# EasyEDA Pro project Hacker Card PCB.epro

# Board PCB_PCB_Hacker-card_2026-08-12
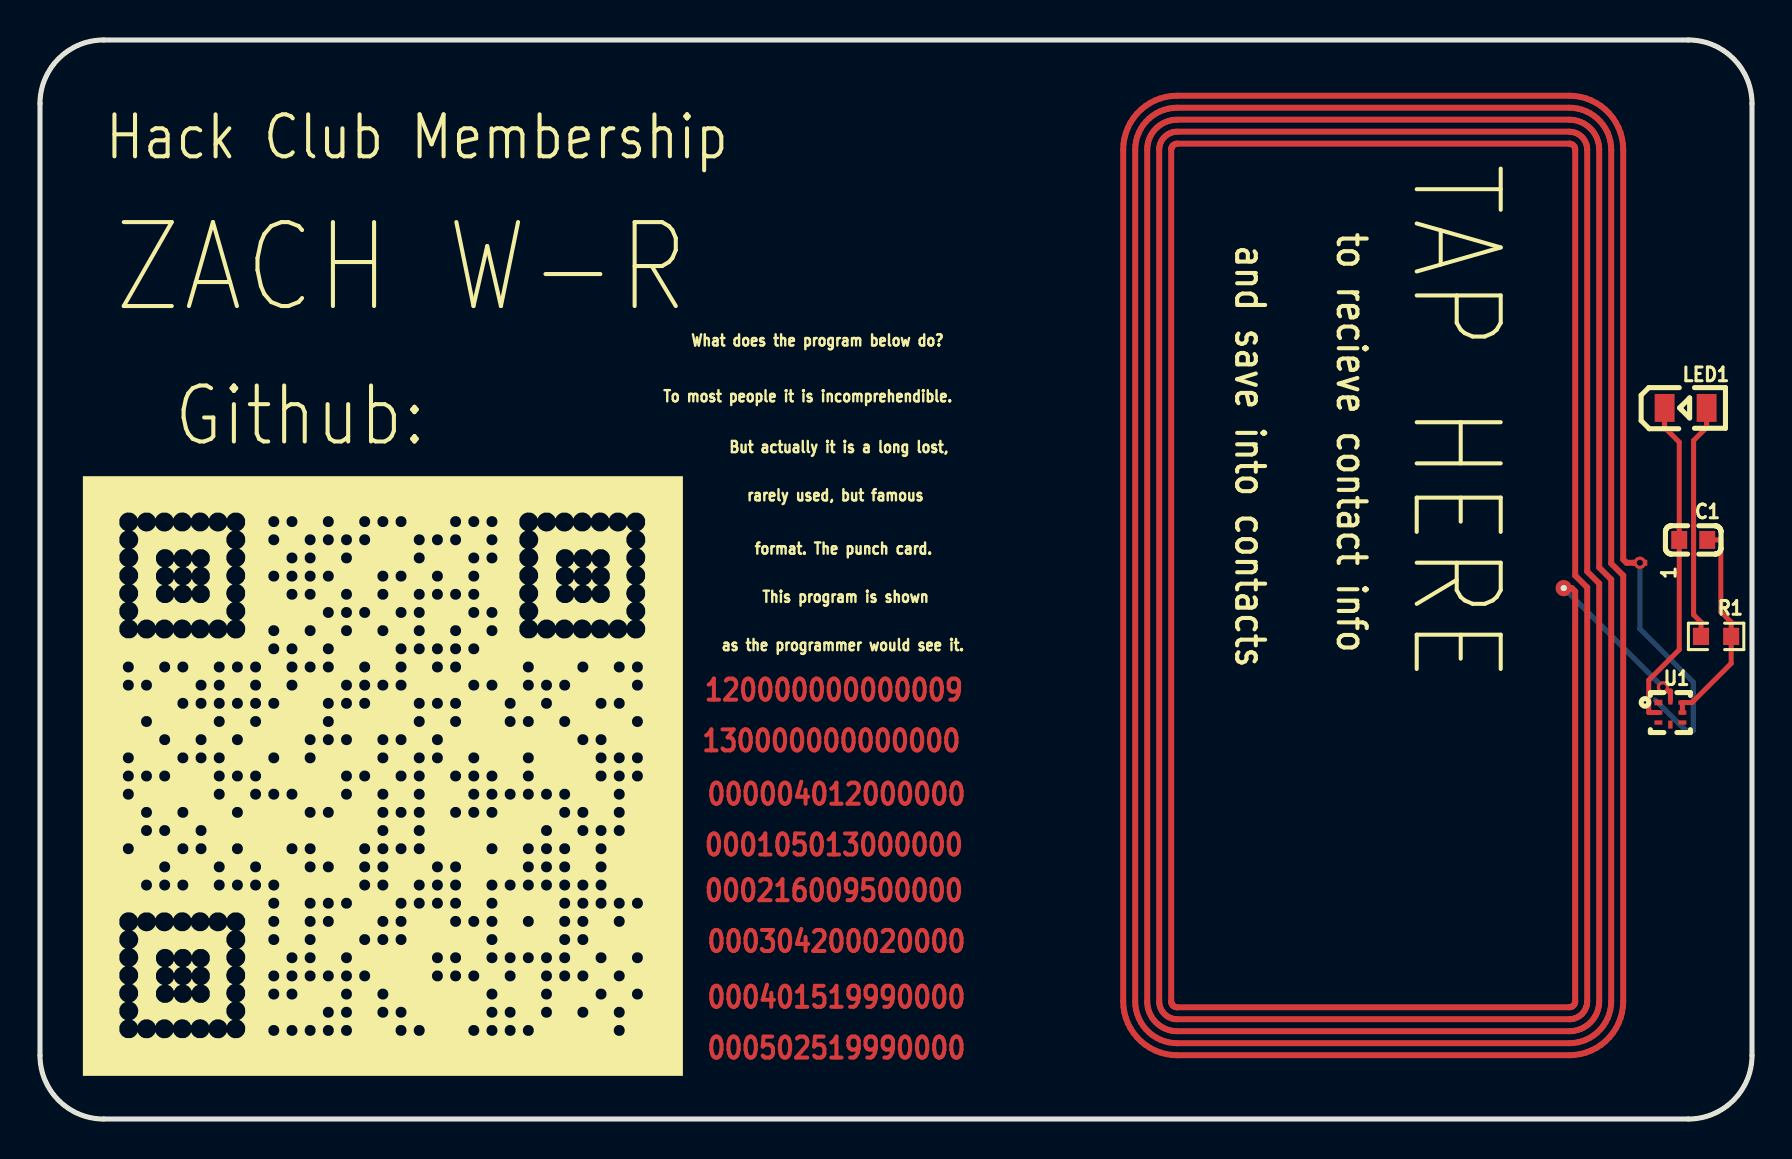
[diagram p0: board, top side]
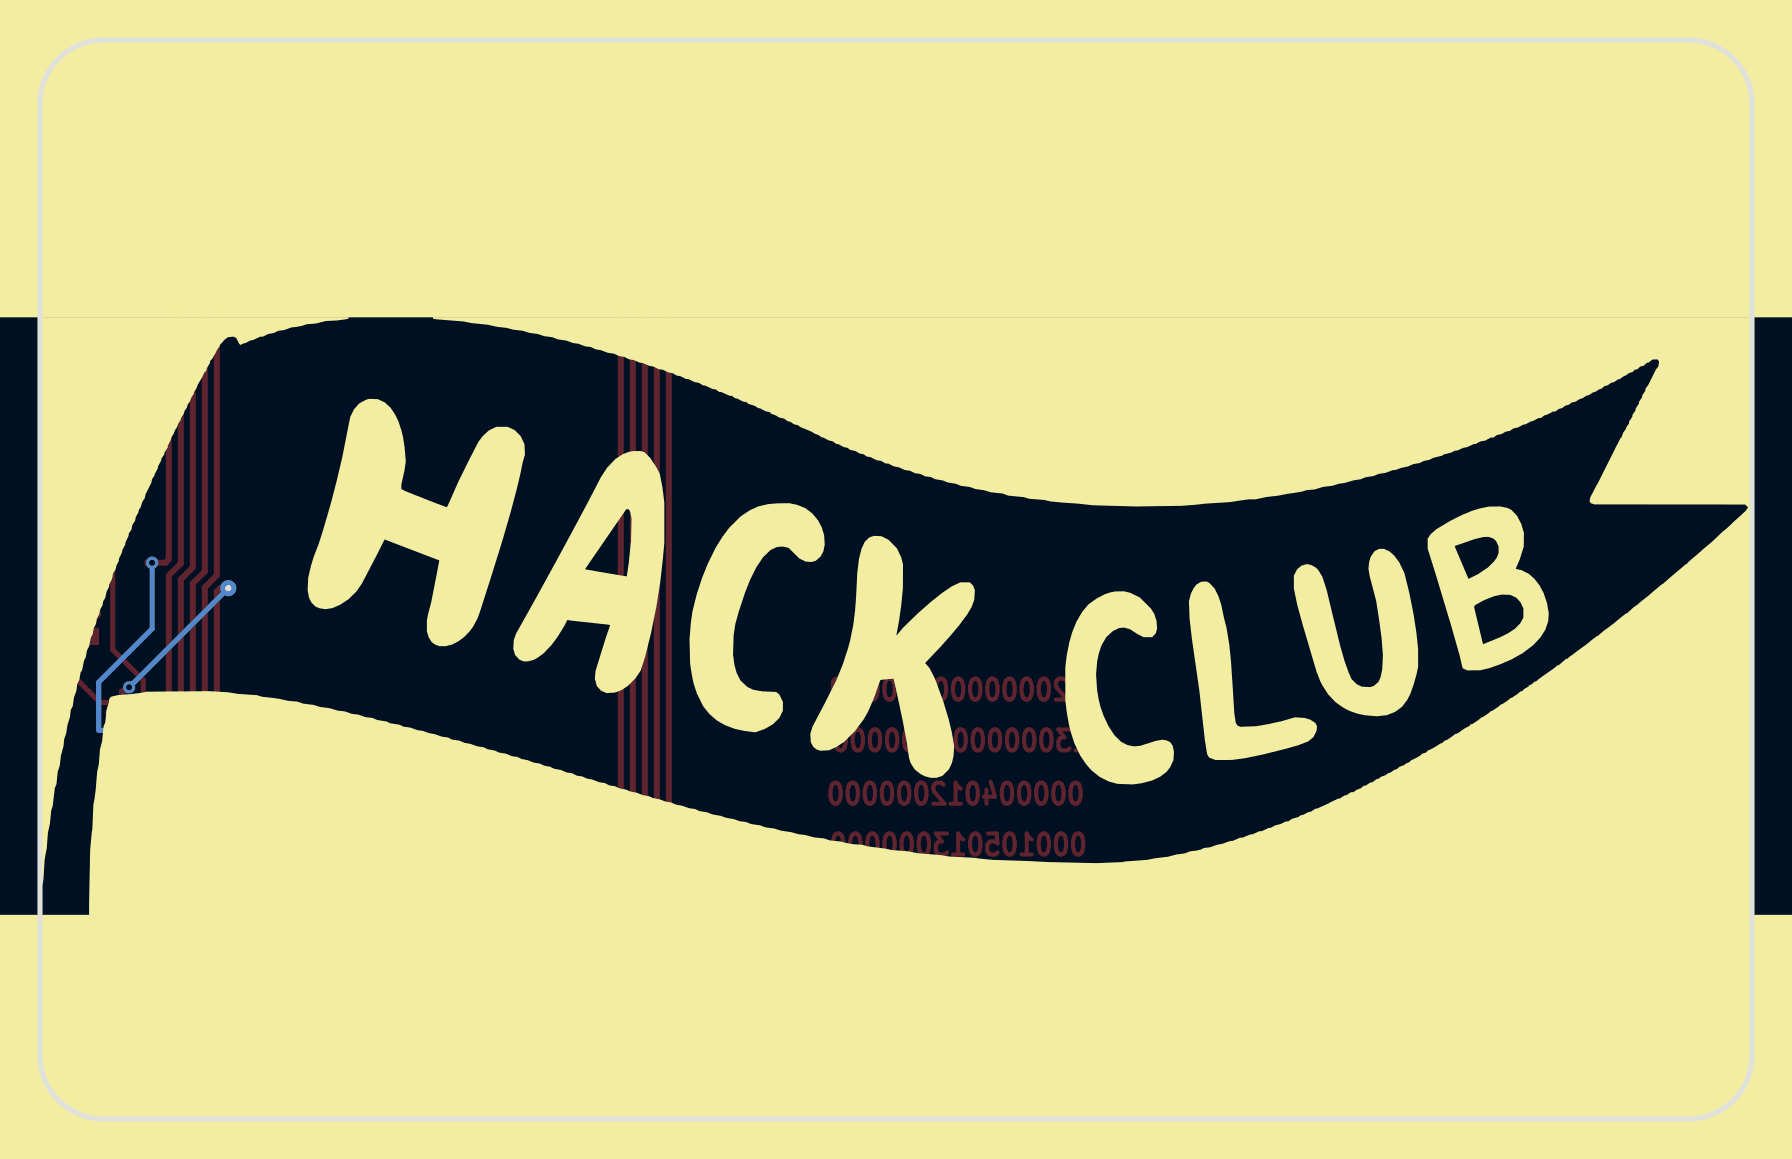
[diagram p1: board, bottom side, seen from below]

Outline 85.6 x 53.98 mm; copper layers: Top Layer, Bottom Layer. Coordinates in mm from the lower left corner of the outline.
Outline path: 0,50.8 arc(0.93,53.05) 3.18,53.98 82.42,53.98 arc(84.67,53.05) 85.6,50.8 85.6,3.18 arc(84.67,0.93) 82.42,0 3.18,0 arc(0.93,0.93) 0,3.18 0,50.8
Stack: Top Layer 0.035mm / Bottom Layer 0.035mm

## Design rules (mm)
spacing Default (default): track to track 0.102, other pairs 0 to 0.3
track width Default (default): min 0.254, default 0.254, max 25.4
differential pair differentialPair (default): width min 0.127, default 2.54, max 2.54; gap min 0.127, default 0.152

## Placement (name value [footprint] x y rotation side)
1  -  [25X48MM_NFC_ANTENNA]  66.66 27.19 270 top
C1  220nF  [C0603]  82.66 28.97 0 top
LED1  0805G (Green)  [LED0805-R-RD]  82.28 35.57 0 top
R1  47Ω  [R0603]  83.81 24.14 0 top
U1  NT3H2111W0FHKH  [XQFN-8_L1.6-W1.6-P0.50-BL_NT3H2111W0FHKH]  81.52 20.33 0 top

## Footprints (pads in the part's own frame, mm; a bottom-side part is the same pattern mirrored in y, then rotated)
25X48MM_NFC_ANTENNA
  rect 0.3x0.75 smd: P$1(-0.635,13.335)
  round 0.808 hole 0.3x0.3: P$2(0.635,9.525)
C0603
  rect 0.8x0.9 smd: 1(-0.7,0) 2(0.7,0)
LED0805-R-RD
  rect 1x1.399 smd: 1(1.05,0) 2(-1.05,0)
R0603
  rect 0.806x0.864 smd: 1(-0.753,0) 2(0.753,0)
XQFN-8_L1.6-W1.6-P0.50-BL_NT3H2111W0FHKH
  rect 0.4x0.28 smd: 1(-0.6,0.5)
  rect 0.4x0.22 smd: 2(-0.6,0) 3(-0.6,-0.5) 5(0.6,-0.5) 6(0.6,0) 7(0.6,0.5)
  rect 0.22x0.4 smd: 4(0,-0.6) 8(0,0.6)

## Nets
LED1_1: LED1.1 R1.1
U1_1: 1.P$1 U1.1
U1_2: C1.1 LED1.2 U1.2
U1_3: U1.3
U1_4: U1.4
U1_5: U1.5
U1_6: C1.2 R1.2 U1.6 U1.7
U1_8: 1.P$2 U1.8

## Via types
v1: diameter 0.62, hole 0.31, Top Layer to Bottom Layer, 1 via
v2: diameter 0.61, hole 0.305, Top Layer to Bottom Layer, 1 via

## Routing (per net, layer and track width the routed paths; a pad name or vN(x,y) marks a point on that pad's centre or on a via; arc(x,y) is an arc through that point)
LED1_1: length 11.9
  Top Layer w0.254: LED1.1 83.33,34.59 82.68,33.94 82.68,25.23 83.05,24.86 R1.1
U1_1: length 12
  Bottom Layer w0.254: v1(80,27.83) 80,24.52 82.66,21.86 82.66,19.44 82.28,19.44 80.76,20.97
U1_2: length 16.7
  Top Layer w0.254: 80.44,20.33 80.44,21.95 81.96,23.48 C1.1 81.96,33.86 81.23,34.59 LED1.2 ; U1.2 80.44,20.33
U1_6: length 10.8
  Top Layer w0.254: U1.6 U1.7 82.6,20.83 84.56,22.79 R1.2 84.56,24.86 84.04,25.37 84.04,28.97 C1.2
U1_8: length 29.6
  Top Layer w0.254: 1.P$2 76.59,26.56 76.76,26.39 76.76,5.89 76.76,5.87 76.76,5.84 76.75,5.82 76.74,5.79 76.73,5.77 76.72,5.75 76.71,5.73 76.7,5.71 76.68,5.69 76.66,5.67 76.65,5.66 76.63,5.64 76.6,5.63 76.58,5.62 76.56,5.61 76.54,5.6 76.51,5.6 76.49,5.59 76.46,5.59 ; v2(81.14,21.6) 81.33,21.41 81.52,21.41 U1.8
  Bottom Layer w0.254: 1.P$2 v2(81.14,21.6)

## Text on the board
Top Layer: 130000000000000 | 120000000000009 | 000105013000000 | 000216009500000 | 000004012000000 | 000304200020000 | 000401519990000 | 000502519990000
Top Solder Mask Layer: 130000000000000 | 120000000000009 | 000105013000000 | 000216009500000 | 000004012000000 | 000304200020000 | 000401519990000 | 000502519990000
Top Silkscreen Layer: To most people it is incomprehendible. | What does the program below do? | as the programmer would see it. | But actually it is a long lost, | rarely used, but famous | format. The punch card. | This program is shown | and save into contacts | to recieve contact info | Hack Club Membership | Github: | ZACH W-R | TAP HERE
